# Altium schematic sheet Buck.SchDoc
size A4
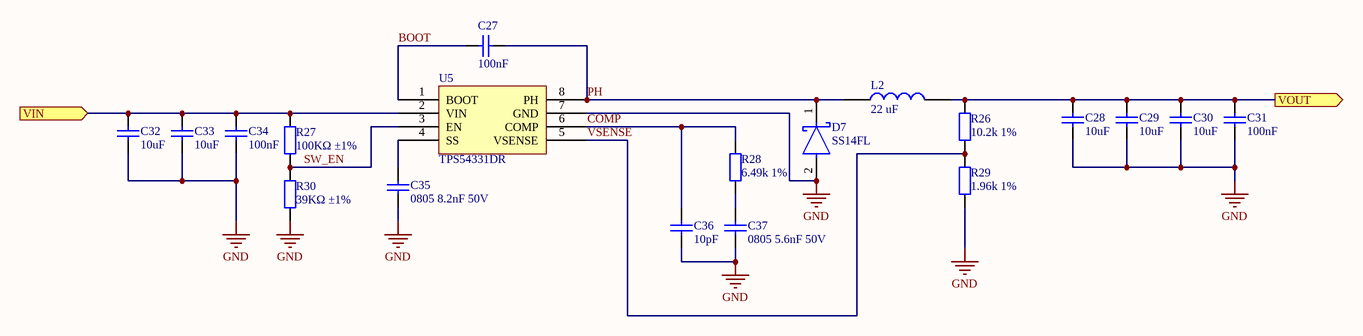
[diagram p0: Buck.SchDoc]

## Parts
C27  100nF  [0603_C]
C28  10uF  [0603_C]
C29  10uF  [0603_C]
C30  10uF  [0603_C]
C31  100nF  [0603_C]
C32  10uF  [0805_C]
C33  10uF  [0805_C]
C34  100nF  [0603_C]
C35  0805 8.2nF 50V  [0805_C]
C36  10pF  [0603_C]
C37  0805 5.6nF 50V  [0805_C]
D7  SS14FL  [FP-425AD-MFG]
L2  22 uF  [COBU-DR74-4R7-R_V]
R26  10.2k 1%  [1206_R]
R27  100KΩ ±1%  [0805_R]
R28  6.49k 1%  [0805_R]
R29  1.96k 1%  [1206_R]
R30  39KΩ ±1%  [0805_R]
U5  TPS54331DR  [SOIC-8_150mil]

## Ports
VIN (in), VOUT (out)

## Nets
GND: C28.1 C29.1 C30.1 C31.1 C32.1 C33.1 C34.1 C35.1 C36.1 C37.1 D7.2(A) R29.1 R30.1 U5.7(GND)
BOOT: C27.2 U5.1(BOOT)
COMP: C36.2 R28.2 U5.6(COMP)
PH: C27.1 D7.1(C) L2.1 U5.8(PH)
SW_EN: R27.2 R30.2 U5.3(EN)
VIN: C32.2 C33.2 C34.2 R27.1 U5.2(VIN) ; port VIN
VOUT: C28.2 C29.2 C30.2 C31.2 L2.2 R26.1 ; port VOUT
VSENSE: R26.2 R29.2 U5.5(VSENSE)
NetC35_2: C35.2 U5.4(SS)
NetC37_2: C37.2 R28.1

## Library data of the parts
C27 C31 C34 = 0603 100nF (104) 10% 50V: Chip capacitors; Manufacturer: YAGEO; PartNumber: CC0603KRX7R9BB104; Tolerance: 10%; Voltage: 50V; ComponentLink1Description: Supplier link; ComponentLink1URL: http://www.szlcsc.com/product/details_15331.html; Package: 0603; Supplier: LC; SuppliersPartNumber: C14663; Capacitance: 100nF
C28-C30 = 0603 10uF (106) 10% 10V: Chip capacitors; Manufacturer: Samsung Electro-Mechanics; PartNumber: CL10A106KP8NNNC; Tolerance: 10%; Voltage: 10V; ComponentLink1Description: Supplier link; ComponentLink1URL: http://www.szlcsc.com/product/details_20411.html; Package: 0603; Supplier: LC; SuppliersPartNumber: C19702; Capacitance: 10uF
C32 C33 = 0805 10uF (106) 10% 25V: Chip capacitors; Manufacturer: Samsung Electro-Mechanics; PartNumber: CL21A106KAYNNNE; Tolerance: 10%; Voltage: 25V; ComponentLink1Description: Supplier link; ComponentLink1URL: http://www.szlcsc.com/product/details_16532.html; Package: 0805; Supplier: LC; SuppliersPartNumber: C15850; Capacitance: 10uF
C35 = 0805 8.2nF 50V: PartNumber: CL21B822KBANNNC; LCSC: C170117
C36 = 0603 10pF (100) 5% 50V: Chip capacitors; Manufacturer: Samsung Electro-Mechanics; PartNumber: CL10C100JB8NNNC; Tolerance: 5%; Voltage: 50V; ComponentLink1Description: Supplier link; ComponentLink1URL: http://www.szlcsc.com/product/details_1986.html; Package: 0603; Supplier: LC; SuppliersPartNumber: C1634; Capacitance: 10pF
C37 = 0805 5.6nF 50V: PartNumber: CL21B562KBANNNC; LCSC: C153719
D7 = CMP-07162-000013-1: DIODE SCHOTTKY 40V 1A SOD123F; Manufacturer: ON Semiconductor; Max Junction Temp: +125°C; Value: 60pF; Max Surge Forward Current: 40A; Peak Reverse Current: 30uA; Device Class L3: Schottky Diodes; Reverse Voltage: 40V; Automotive: No; Temperature: -55°C to +125°C; Mouser Description: SS14FL Series 40 V 1 A Surface Mount Schottky Barrier Rectifier - SOD-123F; Octopart: https://octopart.com/ss14fl-on+semiconductor-84331601; Height: 1.08mm; Temperature Range Low: -55°C; Category: Diode; Lead Free: Yes; Device Class L1: Discrete Semiconductors; Digikey Description: DIODE SCHOTTKY 40V 1A SOD123F; RoHS: TRUE; ComponentLink2Description: Datasheet; Manufacturer Part Number: SS14FL; Forward Current: 1A; Capacitance: 60pF; Package: 425AD; Device Class L2: Diodes; Temperature Range High: +125°C; Max Repetitive Reverse Voltage: 40V; ComponentLink2URL: https://www.onsemi.com/pub/Collateral/SS14FL-D.PDF
L2 = SRP6540-5R6M
R26 = 1206 10.2k 1%: PartNumber: 1206W4F1022T5E; LCSC: C247410
R27 = 0805 100K (1003) 1%: Chip resistor; Manufacturer: Uniroyal Elec; Power: 1/8W; ComponentLink1Description: Supplier link; ComponentLink1URL: http://www.szlcsc.com/product/details_18095.html; Package: 0805; Supplier: LC; SuppliersPartNumber: C17407; Tolerance: 1%
R28 = 0805 6.49k 1%: PartNumber: 0805W8F6491T5E; LCSC: C17769
R29 = 1206 1.96k 1%: PartNumber: 1206W4F1022T5E; LCSC: C247410
R30 = 0805 39K (3902) 1%: Chip resistor; Manufacturer: Uniroyal Elec; Power: 1/8W; ComponentLink1Description: Supplier link; ComponentLink1URL: http://www.szlcsc.com/product/details_26569.html; Package: 0805; Supplier: LC; SuppliersPartNumber: C25826; Tolerance: 1%
U5 = TPS54331DR_[C9865]: DC-DC芯片; ComponentLink1Description: 供应商链接; ComponentLink1URL: http://www.szlcsc.com/product/details_10397.html; Package: SOIC-8_150mil; Supplier: LC; SuppliersPartNumber: C9865